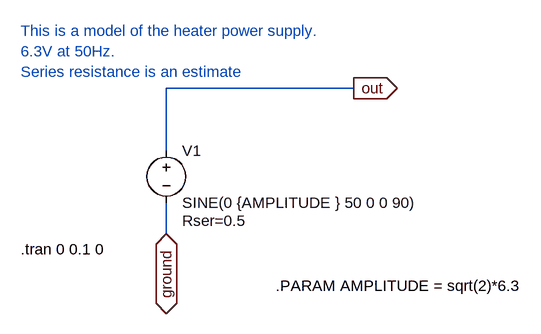
[diagram p0: schematic heater_psu.asc]
heater_psu.asc, the LTspice schematic file:
Version 4
SHEET 1 880 680
WIRE 528 64 240 64
WIRE 240 160 240 64
WIRE 240 288 240 240
FLAG 528 64 out
IOPIN 528 64 Out
FLAG 240 288 ground
IOPIN 240 288 BiDir
SYMBOL voltage 240 144 R0
WINDOW 123 0 0 Left 2
WINDOW 39 24 124 Left 2
SYMATTR SpiceLine Rser=0.5
SYMATTR InstName V1
SYMATTR Value SINE(0 {AMPLITUDE } 50 0 0 90)
TEXT 16 -24 Left 2 ;This is a model of the heater power supply.\n6.3V at 50Hz.\nSeries resistance is an estimate
TEXT 16 312 Left 2 !.tran 0 0.1 0
TEXT 408 368 Left 2 !.PARAM AMPLITUDE = sqrt(2)*6.3

The netlist it stands for:
* heater_psu.asc
V1 out ground SINE(0 {AMPLITUDE } 50 0 0 90) Rser=0.5
* This is a model of the heater power supply.
* 6.3V at 50Hz.
* Series resistance is an estimate
.tran 0 0.1 0
.PARAM AMPLITUDE = sqrt(2)*6.3
.backanno
.end